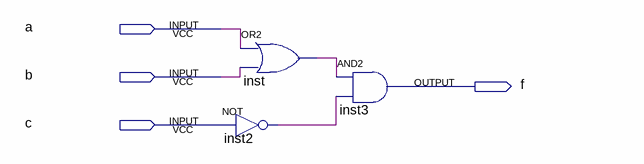
[diagram p0: schematic sheet]
// Quartus schematic lab2step1.bdf as structural Verilog: 3 symbols, 4 pins
module lab2step1 (
  input  a,
  input  b,
  input  c,
  output f
);

  wire inst2_out, inst_out;

  or inst (inst_out, a, b);
  not inst2 (inst2_out, c);
  and inst3 (f, inst_out, inst2_out);
endmodule
